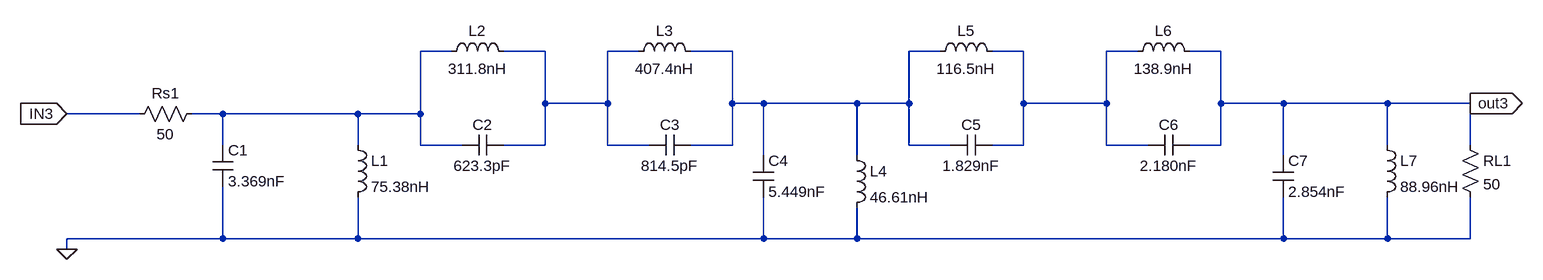
[diagram p0: schematic BPF3.asc]
BPF3.asc, the LTspice schematic file:
Version 4
SHEET 1 1328 680
WIRE -352 32 -400 32
WIRE -208 32 -272 32
WIRE -64 32 -112 32
WIRE 80 32 16 32
WIRE 400 32 352 32
WIRE 528 32 480 32
WIRE 704 32 656 32
WIRE 832 32 784 32
WIRE -208 112 -208 32
WIRE -112 112 -112 32
WIRE -112 112 -208 112
WIRE 80 112 80 32
WIRE 128 112 80 112
WIRE 272 112 128 112
WIRE 352 112 352 32
WIRE 352 112 272 112
WIRE 528 112 528 32
WIRE 656 112 656 32
WIRE 656 112 528 112
WIRE 832 112 832 32
WIRE 928 112 832 112
WIRE 1088 112 928 112
WIRE 1216 112 1088 112
WIRE -832 128 -944 128
WIRE -704 128 -752 128
WIRE -496 128 -704 128
WIRE -400 128 -400 32
WIRE -400 128 -496 128
WIRE -704 176 -704 128
WIRE -496 176 -496 128
WIRE -400 176 -400 128
WIRE -336 176 -400 176
WIRE -208 176 -208 112
WIRE -208 176 -272 176
WIRE -112 176 -112 112
WIRE -48 176 -112 176
WIRE 80 176 80 112
WIRE 80 176 16 176
WIRE 352 176 352 112
WIRE 416 176 352 176
WIRE 528 176 528 112
WIRE 528 176 480 176
WIRE 656 176 656 112
WIRE 720 176 656 176
WIRE 832 176 832 112
WIRE 832 176 784 176
WIRE 1088 176 1088 112
WIRE 1216 176 1216 112
WIRE 128 192 128 112
WIRE 272 192 272 112
WIRE 928 192 928 112
WIRE -704 320 -704 240
WIRE -704 320 -944 320
WIRE -496 320 -496 256
WIRE -496 320 -704 320
WIRE 128 320 128 256
WIRE 128 320 -496 320
WIRE 272 320 272 272
WIRE 272 320 128 320
WIRE 928 320 928 256
WIRE 928 320 272 320
WIRE 1088 320 1088 256
WIRE 1088 320 928 320
WIRE 1216 320 1216 256
WIRE 1216 320 1088 320
WIRE -944 336 -944 320
FLAG -944 336 0
FLAG 1216 112 out3
IOPIN 1216 112 Out
FLAG -944 128 IN3
IOPIN -944 128 In
SYMBOL res -736 112 R90
WINDOW 0 0 56 VBottom 2
WINDOW 3 32 56 VTop 2
SYMATTR InstName Rs1
SYMATTR Value 50
SYMBOL cap -720 176 R0
SYMATTR InstName C1
SYMATTR Value 3.369nF
SYMBOL ind -512 160 R0
SYMATTR InstName L1
SYMATTR Value 75.38nH
SYMBOL ind -368 48 R270
WINDOW 0 32 56 VTop 2
WINDOW 3 5 56 VBottom 2
SYMATTR InstName L2
SYMATTR Value 311.8nH
SYMBOL cap -272 160 R90
WINDOW 0 0 32 VBottom 2
WINDOW 3 32 32 VTop 2
SYMATTR InstName C2
SYMATTR Value 623.3pF
SYMBOL ind -80 48 R270
WINDOW 0 32 56 VTop 2
WINDOW 3 5 56 VBottom 2
SYMATTR InstName L3
SYMATTR Value 407.4nH
SYMBOL cap -48 192 R270
WINDOW 0 32 32 VTop 2
WINDOW 3 0 32 VBottom 2
SYMATTR InstName C3
SYMATTR Value 814.5pF
SYMBOL cap 112 192 R0
SYMATTR InstName C4
SYMATTR Value 5.449nF
SYMBOL ind 256 176 R0
SYMATTR InstName L4
SYMATTR Value 46.61nH
SYMBOL ind 384 48 R270
WINDOW 0 32 56 VTop 2
WINDOW 3 5 56 VBottom 2
SYMATTR InstName L5
SYMATTR Value 116.5nH
SYMBOL cap 480 160 R90
WINDOW 0 0 32 VBottom 2
WINDOW 3 32 32 VTop 2
SYMATTR InstName C5
SYMATTR Value 1.829nF
SYMBOL ind 688 48 R270
WINDOW 0 32 56 VTop 2
WINDOW 3 5 56 VBottom 2
SYMATTR InstName L6
SYMATTR Value 138.9nH
SYMBOL cap 720 192 R270
WINDOW 0 32 32 VTop 2
WINDOW 3 0 32 VBottom 2
SYMATTR InstName C6
SYMATTR Value 2.180nF
SYMBOL cap 912 192 R0
SYMATTR InstName C7
SYMATTR Value 2.854nF
SYMBOL ind 1072 160 R0
SYMATTR InstName L7
SYMATTR Value 88.96nH
SYMBOL res 1200 160 R0
SYMATTR InstName RL1
SYMATTR Value 50

The netlist it stands for:
* BPF3.asc
Rs1 N001 IN3 50
C1 N001 0 3.369nF
L1 N001 0 75.38nH
L2 N001 N002 311.8nH
C2 N002 N001 623.3pF
L3 N002 N003 407.4nH
C3 N002 N003 814.5pF
C4 N003 0 5.449nF
L4 N003 0 46.61nH
L5 N003 N004 116.5nH
C5 N004 N003 1.829nF
L6 N004 out3 138.9nH
C6 N004 out3 2.180nF
C7 out3 0 2.854nF
L7 out3 0 88.96nH
RL1 out3 0 50
.backanno
.end